# EAGLE design ICE_RED_01 (EAGLE 6.5.0)
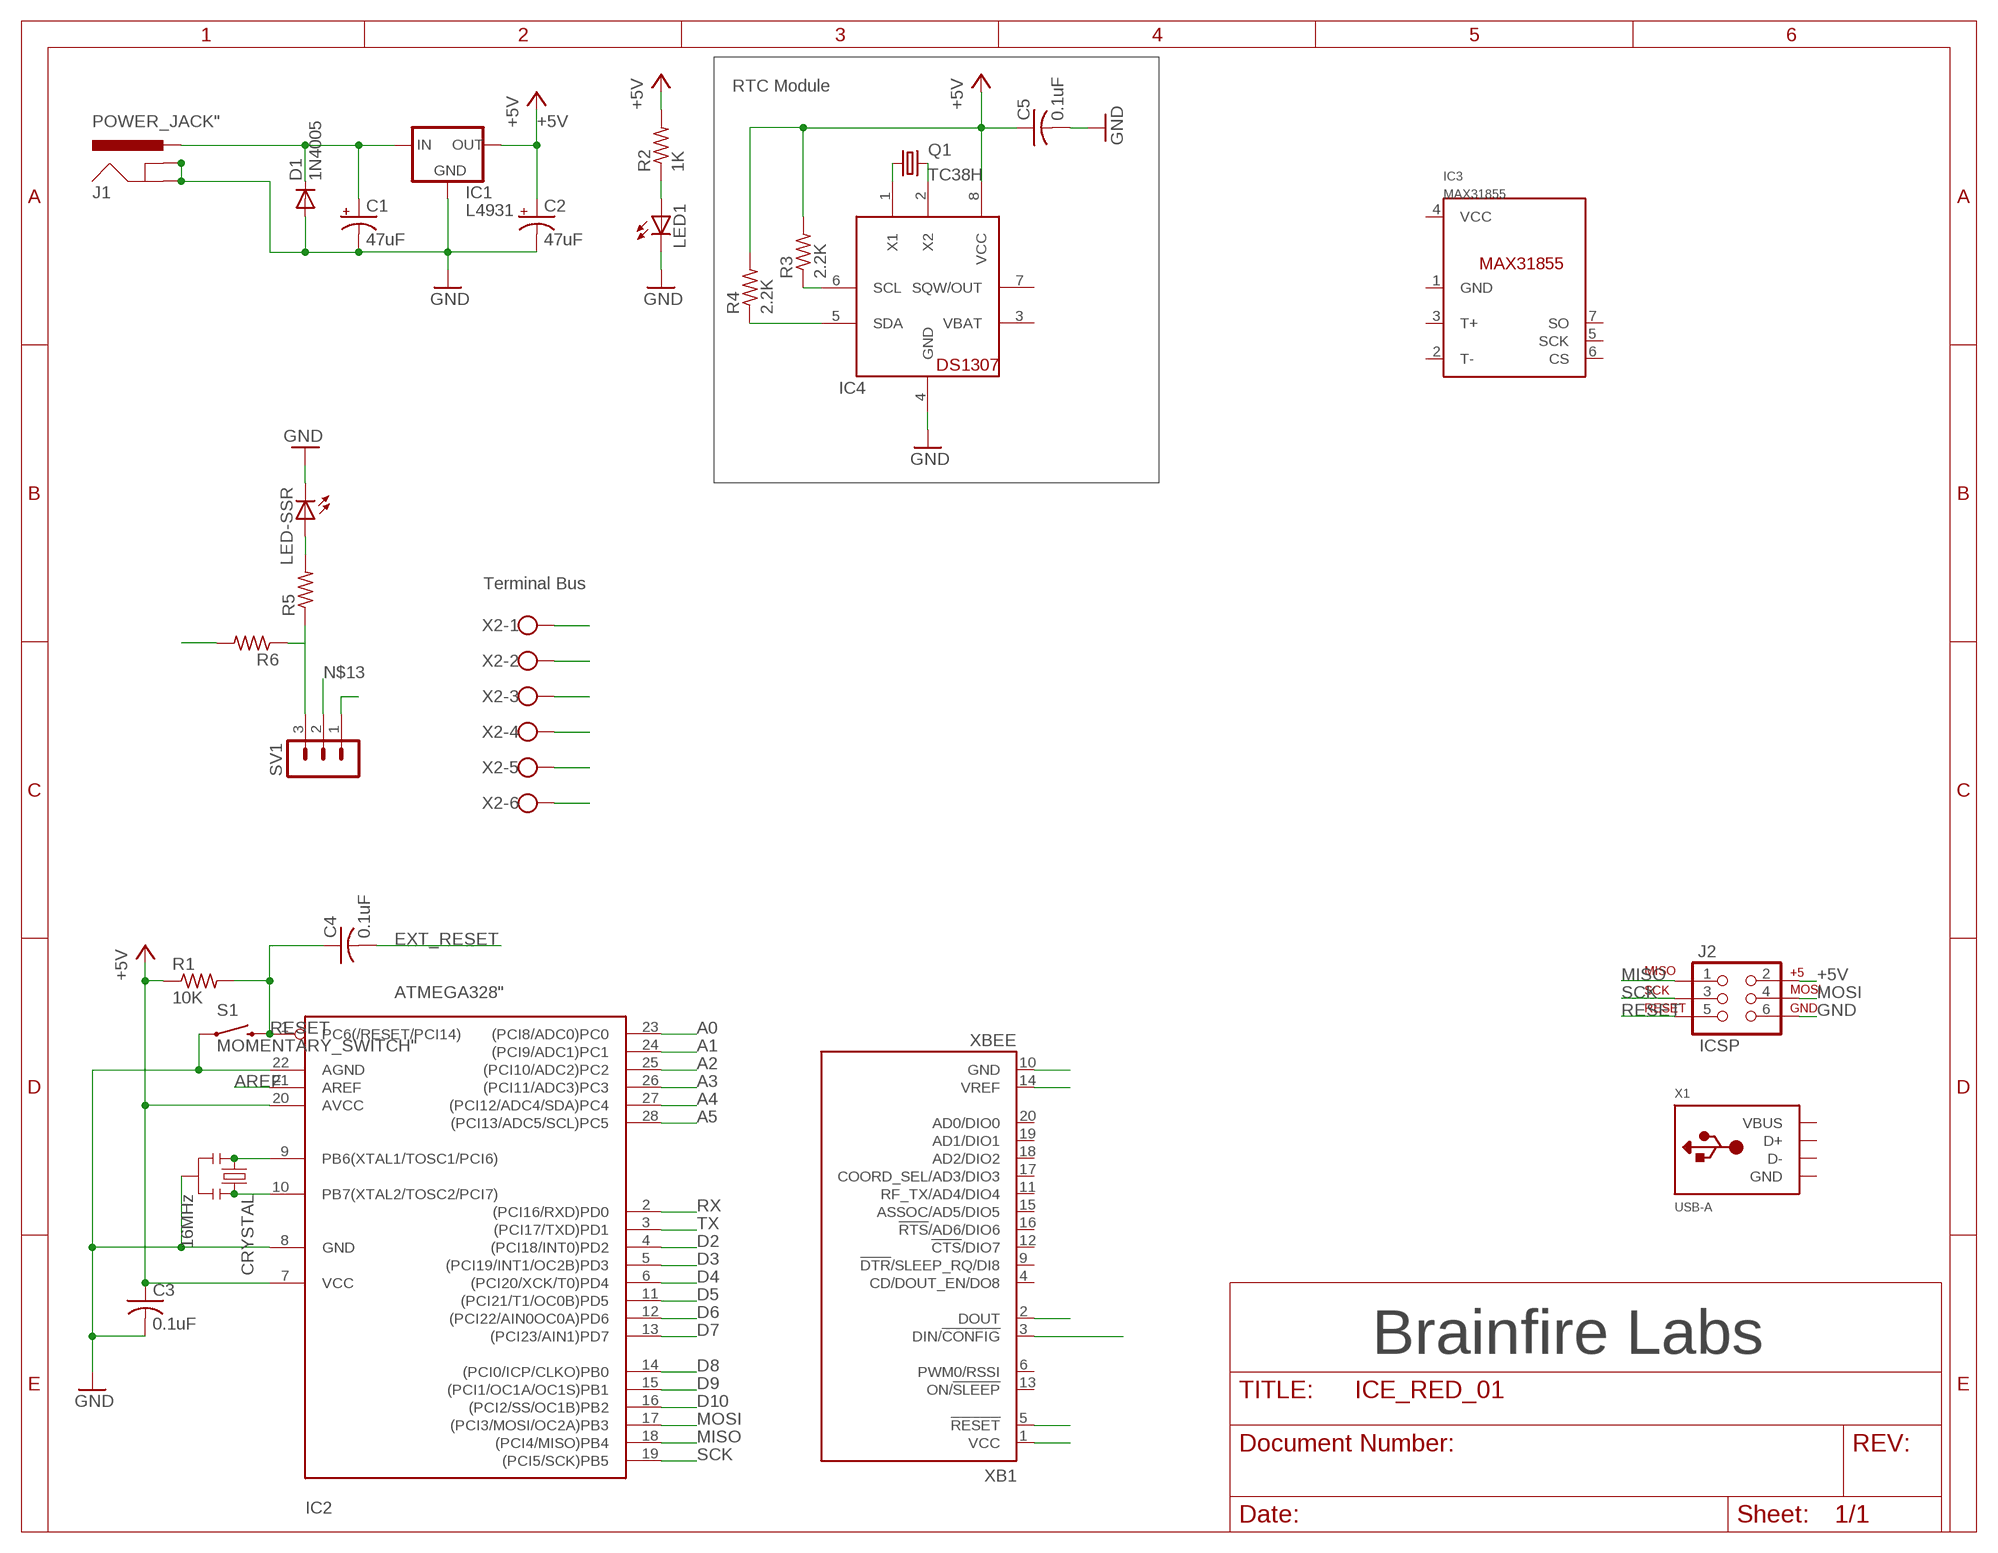
[diagram p0: schematic, sheet 1]

## Parts
C1  47uF  ELECTROLYTIC_CAP2.54MM  [ELECTROLYTIC_CAP]
C2  47uF  ELECTROLYTIC_CAP2.54MM  [ELECTROLYTIC_CAP]
C3  0.1uF  UNPOLARIZED_CAP"  [UNPOLARIZED_CAP]
C4  0.1uF  UNPOLARIZED_CAP"  [UNPOLARIZED_CAP]
C5  0.1uF  UNPOLARIZED_CAP"  [UNPOLARIZED_CAP]
CRYSTAL  16MHz  RESONATOR"  [RESONATOR]
D1  1N4005  1N4004  [DO41-10]
IC1  L4931  REGULATOR  [L4931_REGULATOR]
IC2  ATMEGA328"  [ATMEGA328]
IC3  MAX31855  [SOIC8]
IC4  DS1307  [DIL08]
J1  POWER_JACK"  [POWER_JACK]
J2  ICSP  AVR_SPI_PRG_6PTH  [2X3]
LED1  LED3MM  [LED]
LED-SSR  LED3MM  [LED]
Q1  TC38H  CRYSTALTC38H  [TC38H]
R1  10K  RESISTOR1/6WATT  [RESISTOR]
R2  1K  RESISTOR1/6WATT  [RESISTOR]
R3  2.2K  R-US_0204/5  [0204/5]
R4  2.2K  R-US_0204/5  [0204/5]
R5  RESISTOR1/6WATT  [RESISTOR]
R6  RESISTOR1/6WATT  [RESISTOR]
S1  MOMENTARY_SWITCH"  [MOMENTARY_SWITCH]
SV1  MA03-1  [MA03-1]
X1  USB-A  [MOLEX_480371000]
X2  W237-6  [W237-6]
XB1  XBEE  [XBEE]

## Nets
+3.3V: XB1.1(VCC)
+5V: C2.+ C3.1 C5.1 IC1.OUT IC2.7(VCC) IC2.20(AVCC) IC4.8(VCC) J2.2 R1.1 R2.2 R3.2 R4.2
A0: IC2.23((PCI8/ADC0)PC0)
A1: IC2.24((PCI9/ADC1)PC1)
A2: IC2.25((PCI10/ADC2)PC2)
A3: IC2.26((PCI11/ADC3)PC3)
A4: IC2.27((PCI12/ADC4/SDA)PC4)
A5: IC2.28((PCI13/ADC5/SCL)PC5)
AREF: IC2.21(AREF)
D2: IC2.4((PCI18/INT0)PD2)
D3: IC2.5((PCI19/INT1/OC2B)PD3)
D4: IC2.6((PCI20/XCK/T0)PD4)
D5: IC2.11((PCI21/T1/OC0B)PD5)
D6: IC2.12((PCI22/AIN0OC0A)PD6)
D7: IC2.13((PCI23/AIN1)PD7)
D8: IC2.14((PCI0/ICP/CLKO)PB0)
D9: IC2.15((PCI1/OC1A/OC1S)PB1)
D10: IC2.16((PCI2/SS/OC1B)PB2)
EXT_RESET: C4.2
GND: C1.- C2.- C3.2 C5.2 CRYSTAL.2 D1.A IC1.GND IC2.8(GND) IC2.22(AGND) IC4.4(GND) J1.GND J1.GNDBREAK J2.6 LED1.K(C) LED-SSR.K(C) S1.1 X2.1 XB1.10(GND)
MISO: IC2.18((PCI4/MISO)PB4) J2.1
MOSI: IC2.17((PCI3/MOSI/OC2A)PB3) J2.4
N$1: CRYSTAL.1 IC2.9(PB6(XTAL1/TOSC1/PCI6))
N$2: C1.+ D1.C IC1.IN J1.PWR
N$3: CRYSTAL.3 IC2.10(PB7(XTAL2/TOSC2/PCI7))
N$4: IC4.1(X1) Q1.1
N$5: LED1.A R2.1
N$6: IC4.2(X2) Q1.2
N$7: IC4.5(SDA) R4.1
N$8: IC4.6(SCL) R3.1
N$12: SV1.1
N$13: SV1.2
N$14: R5.1 R6.1 SV1.3
N$15: LED-SSR.A R5.2
N$17: XB1.14(VREF)
N$21: XB1.5(!RESET)
RELAY1: X2.3
RELAY2: X2.4
RESET: C4.1 IC2.1(PC6(/RESET/PCI14)) J2.5 R1.2 S1.3
RX: IC2.2((PCI16/RXD)PD0) XB1.2(DOUT)
SCK: IC2.19((PCI5/SCK)PB5) J2.3
SSR: R6.2 X2.2
T+: X2.5
T-: X2.6
TX: IC2.3((PCI17/TXD)PD1) XB1.3(DIN/!CONFIG)
Unconnected: IC3.2(T-) IC3.3(T+) IC3.5(SCK) IC3.6(CS) IC3.7(SO) IC4.7(SQW/OUT) X1.2(D-) X1.3(D+) XB1.4(CD/DOUT_EN/DO8) XB1.6(PWM0/RSSI) XB1.9(!DTR!/SLEEP_RQ/DI8) XB1.11(RF_TX/AD4/DIO4) XB1.12(!CTS!/DIO7) XB1.13(ON/!SLEEP) XB1.15(ASSOC/AD5/DIO5) XB1.16(!RTS!/AD6/DIO6) XB1.17(COORD_SEL/AD3/DIO3) XB1.18(AD2/DIO2) XB1.19(AD1/DIO1) XB1.20(AD0/DIO0)

## Notes on the sheet
- RTC Module
- Terminal Bus
- Brainfire Labs

## Power pins joined to a net without a drawn wire
GND: IC3.1(GND) X1.4(GND)
VBAT: IC4.3(VBAT)
VBUS: X1.1(VBUS)
VCC: IC3.4(VCC)

## Library data of the parts
C1 C2 = RBBB:ELECTROLYTIC_CAP: POLARIZED CAPACITOR, American symbol
C3-C5 = RBBB:UNPOLARIZED_CAP: CAPACITOR, American symbol
CRYSTAL = RBBB:RESONATOR: Resonator Small SMD resonator. This is the itty bitty 10/20MHz resonators with built in caps. CSTCE10M0G55 and CSTCE20M0V53. Footprint has been reviewed closely but hasn t been tested yet.'
D1 = diode:1N4004: DIODE general purpose rectifier, 1 A
IC1 = RBBB:REGULATOR: VOLTAGE REGULATOR
IC2 = RBBB:ATMEGA328: MICROCONTROLLER 16 kBytes FLASH 1 kBytes SRAM 512 Bytes EEPROM USART 8-channel 10 bit ADC
IC3 = AlexW-Eagle-Libraries:MAX31855
IC4 = adafruit:DS1307: DS1307 Real time clock (RTC) with battery backup ability. Talk to it via i2c
J1 = RBBB:POWER_JACK: Power Jack This is the standard 5.5mm barrel jack for power. The PTH is the most common, proven, reliable, footprint. All others are experimental. The Slot footprint only works if the mill layer is transmitted to the PCB fab house so be warned. Spark Fun Electronics SKU : PRT-00119. Mating wall wart : TOL-00298 (and others)
J2 = SparkFun-Connectors:AVR_SPI_PRG_6: AVR ISP 6 Pin This is the reduced ISP connector for AVR programming. Common on Arduino. This footprint will take up less PCB space and can be used with a 10-pin to 6-pin adapter such as SKU: BOB-08508
LED1 LED-SSR = RBBB:LED: LED OSRAM: - CHIPLED LG R971, LG N971, LY N971, LG Q971, LY Q971, LO R971, LY R971 LH N974, LH R974 LS Q976, LO Q976, LY Q976 LO Q996 - Hyper CHIPLED LW Q18S LB Q993, LB Q99A, LB R99A - SideLED LS A670, LO A670, LY A670, LG A670, LP A670 LB A673, LV A673, LT A673, LW A673 LH A674 LY A675 LS A676, LA A676, LO A676, LY A676, LW A676 LS A679, LY A679, LG A679 - Hyper Micro SIDELED® LS Y876, LA Y876, LO Y876, LY Y876 LT Y87S - SmartLED LW L88C, LW L88S LB L89C, LB L89S, LG L890 LS L89K, LO L89K, LY L89K LS L896, LA L896, LO L896, LY L896 - TOPLED LS T670, LO T670, LY T670, LG T670, LP T670 LSG T670, LSP T670, LSY T670, LOP T670, LYG T670 LG T671, LOG T671, LSG T671 LB T673, LV T673, LT T673, LW T673 LH T674 LS T676, LA T676, LO T676, LY T676, LB T676, LH T676, LSB T676, LW T676 LB T67C, LV T67C, LT T67C, LS T67K, LO T67K, LY T67K, LW E67C LS E67B, LA E67B, LO E67B, LY E67B, LB E67C, LV E67C, LT E67C LW T67C LS T679, LY T679, LG T679 LS T770, LO T770, LY T770, LG T770, LP T770 LB T773, LV T773, LT T773, LW T773 LH T774 LS E675, LA E675, LY E675, LS T675 LS T776, LA T776, LO T776, LY T776, LB T776 LHGB T686 LT T68C, LB T68C - Hyper Mini TOPLED® LB M676 - Mini TOPLED Santana® LG M470 LS M47K, LO M47K, LY M47K Source: http://www.osram.convergy.de LUXEON: - LUMILED® LXK2-PW12-R00, LXK2-PW12-S00, LXK2-PW14-U00, LXK2-PW14-V00 LXK2-PM12-R00, LXK2-PM12-S00, LXK2-PM14-U00 LXK2-PE12-Q00, LXK2-PE12-R00, LXK2-PE12-S00, LXK2-PE14-T00, LXK2-PE14-U00 LXK2-PB12-K00, LXK2-PB12-L00, LXK2-PB12-M00, LXK2-PB14-N00, LXK2-PB14-P00, LXK2-PB14-Q00 LXK2-PR12-L00, LXK2-PR12-M00, LXK2-PR14-Q00, LXK2-PR14-R00 LXK2-PD12-Q00, LXK2-PD12-R00, LXK2-PD12-S00 LXK2-PH12-R00, LXK2-PH12-S00 LXK2-PL12-P00, LXK2-PL12-Q00, LXK2-PL12-R00 Source: www.luxeon.com KINGBRIGHT: KA-3528ASYC Source: www.kingbright.com
Q1 = adafruit:CRYSTAL: CRYSTAL; OC_FARNELL: unknown; OC_NEWARK: unknown
R1 R2 R5 R6 = RBBB:RESISTOR: RESISTOR, American symbol
R3 R4 = adafruit:R-US_: RESISTOR, American symbol
S1 = RBBB:MOMENTARY_SWITCH
SV1 = con-lstb:MA03-1: PIN HEADER; OC_FARNELL: unknown; OC_NEWARK: unknown
X1 = adafruit:USB-A: USB type A 'plug' Used for things that can directly connect to a USB port, say USB key
X2 = con-wago-500:W237-6: WAGO SCREW CLAMP; OC_FARNELL: unknown; OC_NEWARK: unknown
XB1 = maxstream:XBEE: XBee (TM) /XBee-PRO(TM) OEM RF Modules Source: MaxStream, Inc. xbee_productmanual.pdf; MPN: XBP24-Z7UIT-004; OC_FARNELL: 1751799; OC_NEWARK: 34R5507

## Board
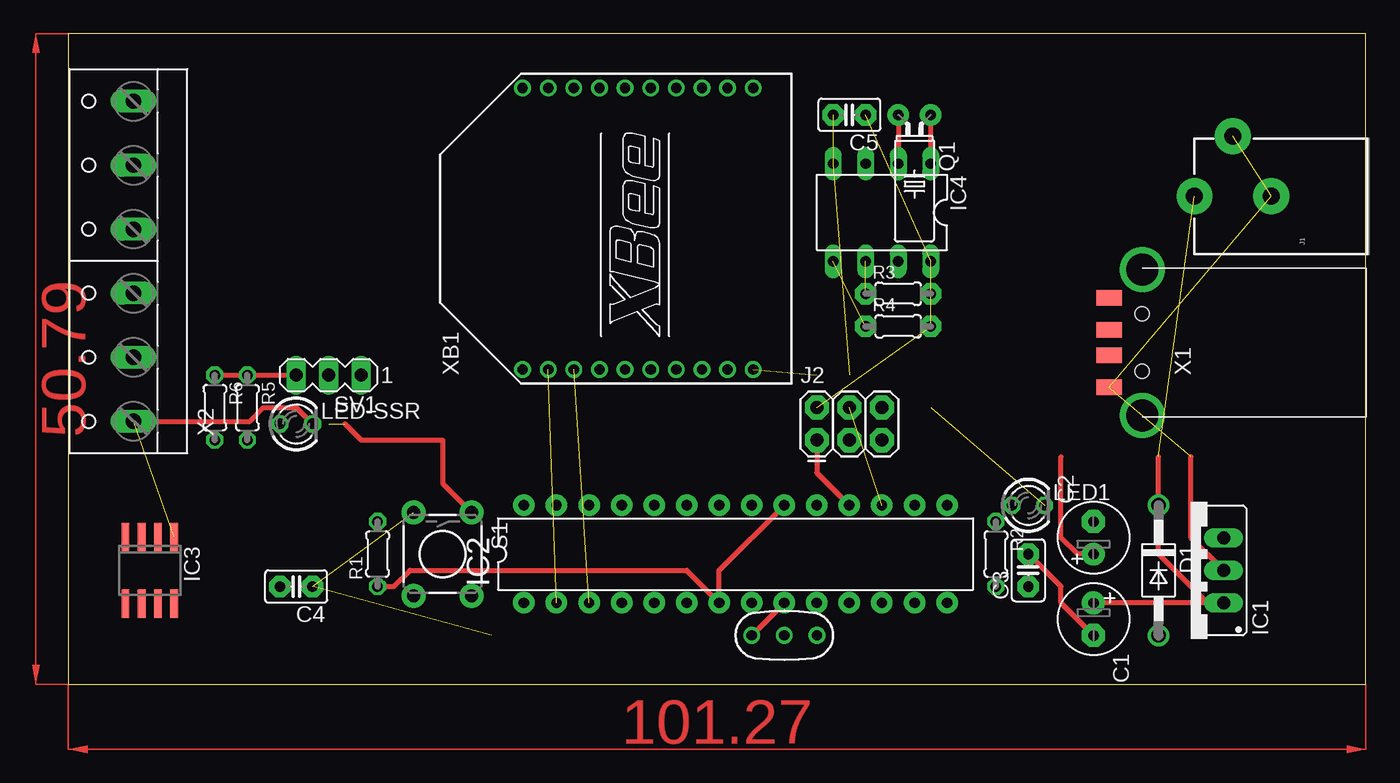
[diagram p1: board, top side]
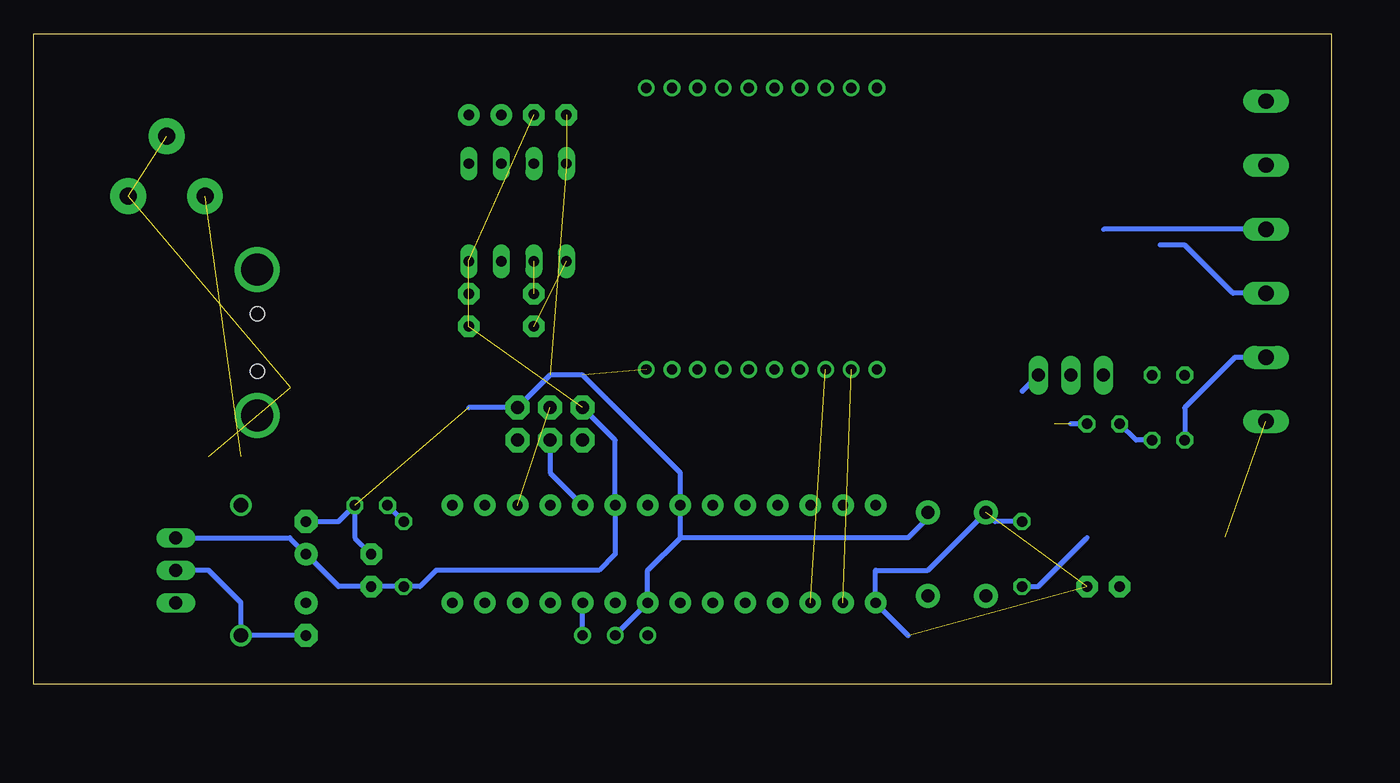
[diagram p2: board, bottom side, seen from below]

Size 101.27 x 50.79 mm. Coordinates in mm from the lower left corner, seen from the top.
Outline: 0,0 101.27,0 101.27,50.79 0,50.79 0,0
Copper layers (1*16): Top 0.035mm / dielectric 1.5mm / Bottom 0.035mm
Design rules "default": minimum track width 10mil, minimum drill 24mil, track to track 8mil, track to pad 8mil, pad to pad 8mil, via to via 8mil, smd to smd 8mil, copper to edge 40mil, drill to drill 8mil, minimum pad ring 10mil, minimum via ring 8mil, stop-mask expansion 4mil, vias tented up to drill 0mil, thermal gap 10mil

### Footprints (pad centres in the part's own frame; a part is rotated, then mirrored left to right if it is on the bottom)
ELECTROLYTIC_CAP = drill 0.813 pad 1.778: + -1.27,0 | drill 0.813 pad 1.778 octagon: - 1.27,0
UNPOLARIZED_CAP = drill 0.813 pad 1.676 octagon: 1 -1.27,0; 2 1.27,0
RESONATOR = drill 0.8: 1 -2.54,0; 2 0,0; 3 2.54,0
DO41-10 = drill 1.118: A 5.08,0; C -5.08,0
L4931_REGULATOR = drill 1.016 long: GND 0,-2.54; IN -2.54,-2.54; OUT 2.54,-2.54
ATMEGA328 = drill 0.813 pad 1.676: 1 -16.51,-3.81; 2 -13.97,-3.81; 3 -11.43,-3.81; 4 -8.89,-3.81; 5 -6.35,-3.81; 6 -3.81,-3.81; 7 -1.27,-3.81; 8 1.27,-3.81; 9 3.81,-3.81; 10 6.35,-3.81; 11 8.89,-3.81; 12 11.43,-3.81; 13 13.97,-3.81; 14 16.51,-3.81; 15 16.51,3.81; 16 13.97,3.81; 17 11.43,3.81; 18 8.89,3.81; 19 6.35,3.81; 20 3.81,3.81; 21 1.27,3.81; 22 -1.27,3.81; 23 -3.81,3.81; 24 -6.35,3.81; 25 -8.89,3.81; 26 -11.43,3.81; 27 -13.97,3.81; 28 -16.51,3.81
SOIC8 = smd 0.6 x 2.2: 1 -1.905,-2.6; 2 -0.635,-2.6; 3 0.635,-2.6; 4 1.905,-2.6; 5 1.905,2.6; 6 0.635,2.6; 7 -0.635,2.6; 8 -1.905,2.6
DIL08 = drill 0.813 long: 1 -3.81,-3.81; 2 -1.27,-3.81; 3 1.27,-3.81; 4 3.81,-3.81; 5 3.81,3.81; 6 1.27,3.81; 7 -1.27,3.81; 8 -3.81,3.81
POWER_JACK = drill 1.321 pad 2.794: GND 0,7.7; GNDBREAK 4.7,10.7; PWR 0,13.7
2X3 = drill 1.016 pad 1.88 octagon: 1 0,0; 2 0,2.54; 3 2.54,0; 4 2.54,2.54; 5 5.08,0; 6 5.08,2.54
LED = drill 0.813 octagon: A -1.27,0; K 1.27,0
TC38H = drill 0.813 pad 1.676: 1 -1.27,0; 2 1.27,0
RESISTOR = drill 0.813 octagon: 1 -2.54,0; 2 2.54,0
0204/5 = drill 0.813 pad 1.676 octagon: 1 -2.54,0; 2 2.54,0
MOMENTARY_SWITCH = drill 1.016 pad 1.88: 1 -3.251,2.261; 2 3.251,2.261; 3 -3.251,-2.261; 4 3.251,-2.261
MA03-1 = drill 1.016 long: 1 -2.54,0; 2 0,0; 3 2.54,0
MOLEX_480371000 = smd 1.2 x 2: 1 3.5,2.6; 2 1,2.6; 3 -1,2.6; 4 -3.5,2.6 | drill 2.5: M1 -5.7,0; M2 5.7,0 | hole 1.1: -2.25,0; 2.25,0
W237-6 = drill 1.194 long: 1 -12.5,-1.27; 2 -7.5,-1.27; 3 -2.5,-1.27; 4 2.5,-1.27; 5 7.5,-1.27; 6 12.5,-1.27
XBEE = drill 0.8 pad 1.27: 1 -11,9; 2 -11,7; 3 -11,5; 4 -11,3; 5 -11,1; 6 -11,-1; 7 -11,-3; 8 -11,-5; 9 -11,-7; 10 -11,-9; 11 11,-9; 12 11,-7; 13 11,-5; 14 11,-3; 15 11,-1; 16 11,1; 17 11,3; 18 11,5; 19 11,7; 20 11,9

### Placement (x,y rotation side)
C1  80.01,5.08 270 top
C2  80.01,11.43 90 top
C3  74.93,8.89 90 top
C4  17.78,7.62 180 top
C5  60.96,44.45 180 top
CRYSTAL  55.88,3.81 0 top
D1  85.09,8.89 270 top
IC1  87.63,8.89 90 top
IC2  52.07,10.16 0 top
IC3  6.35,8.89 180 top
IC4  63.5,36.83 180 top
J1  101.6,38.1 90 top
J2  58.42,19.05 0 top
LED1  74.93,13.97 0 top
LED-SSR  17.78,20.32 0 top
Q1  66.04,44.45 180 top
R1  24.13,10.16 90 top
R2  72.39,10.16 270 top
R3  64.77,30.48 0 top
R4  64.77,27.94 0 top
R5  13.97,21.59 270 top
R6  11.43,21.59 270 top
S1  29.21,10.16 270 top
SV1  20.32,24.13 180 top
X1  83.82,26.67 90 top
X2  3.81,33.02 90 top
XB1  44.45,35.56 90 top

### Tracks (layer width: path | path; a pad name or v marks a point on that pad's centre or on a via)
+5V  (4 unrouted)
  Top 0.406: R1.1 25.4,7.62 26.67,8.89 48.26,8.89 IC2.7 50.8,8.89 IC2.20 | C2.+ 78.74,10.16 77.47,11.43 77.47,17.78
  Bottom 0.406: R1.1 22.86,7.62 19.05,11.43 | J2.2 55.88,19.05 IC2.20 55.88,10.16 57.15,8.89 69.85,8.89 71.12,7.62 R2.2 C3.1 77.47,7.62 C2.+ 81.28,11.43 IC1.OUT
GND  (9 unrouted)
  Top 0.406: X2.1 14.17,20.52 15.24,21.59 17.78,21.59 LED-SSR.K | 21.59,20.32 22.86,19.05 29.21,19.05 29.21,15.67 S1.1 | C1.- 77.47,6.35 77.47,7.62 C3.2 | IC1.GND 87.63,11.43 87.63,17.78
  Bottom 0.406: LED-SSR.K 20.32,20.32 | 50.8,11.43 53.34,8.89 IC2.8 CRYSTAL.2 | 50.8,11.43 IC2.22 50.8,16.51 58.42,24.13 60.96,24.13 J2.6 67.31,21.59 | S1.1 31.47,12.98 33.02,11.43 50.8,11.43 | C1.- D1.A 85.09,6.35 87.63,8.89 IC1.GND | C2.- 77.47,12.7 LED1.K 76.2,11.43 C3.2
MISO
  Top 0.406: J2.1 58.42,16.51 IC2.18
MOSI  (1 unrouted)
N$1
  Top 0.406: CRYSTAL.1 IC2.9
N$2  (1 unrouted)
  Top 0.406: C1.+ IC1.IN 88.9,6.35 85.09,10.16 D1.C 85.09,17.78
N$3
  Bottom 0.406: CRYSTAL.3 IC2.10
N$4
  Top 0.406: IC4.1 Q1.1
N$5
  Bottom 0.406: R2.1 LED1.A
N$6
  Top 0.406: Q1.2 IC4.2
N$7  (1 unrouted)
N$8  (1 unrouted)
N$12
  Bottom 0.406: 24.13,22.86 SV1.1
N$14
  Top 0.406: R6.1 R5.1 SV1.3
N$15
  Bottom 0.406: R5.2 15.24,19.05 LED-SSR.A
RELAY1
  Bottom 0.406: X2.3 7.66,30.52 11.43,34.29 13.34,34.29
RELAY2
  Bottom 0.406: X2.4 17.74,35.52
RESET  (2 unrouted)
  Bottom 0.406: R1.2 26.24,12.7 S1.3 31.47,8.89 35.56,8.89 IC2.1 33.02,3.81
RX  (1 unrouted)
SCK
  Bottom 0.406: J2.3 60.96,16.51 IC2.19
SSR
  Bottom 0.406: X2.2 7.5,25.52 11.43,21.59 R6.2
TX  (1 unrouted)
(copper drawn outside any net)
  shapes: Top area x2